# EAGLE design pix-diff-spi-v1a (EAGLE 9.1.0)
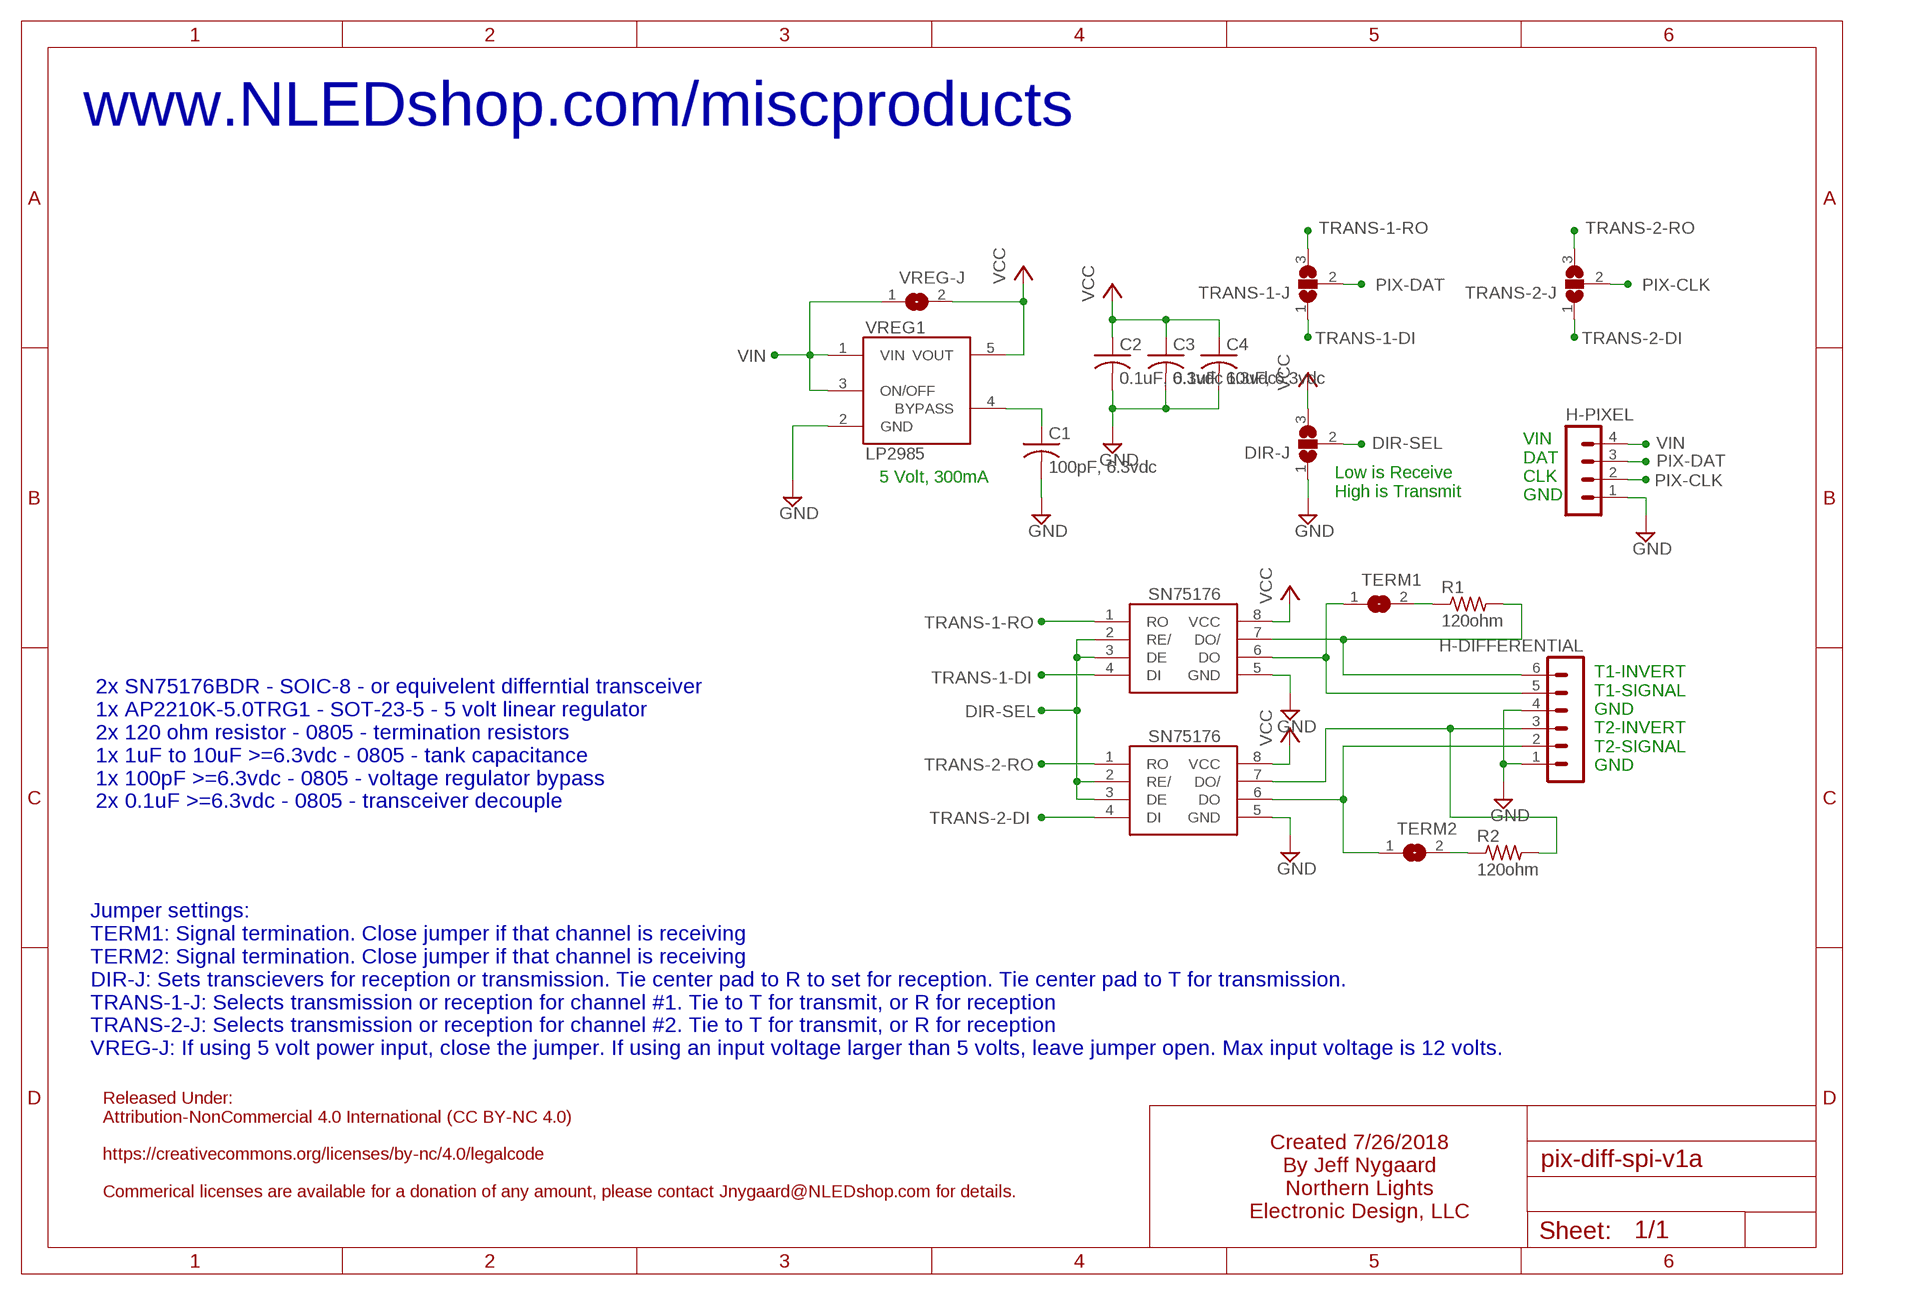
[diagram p0: schematic, sheet 1]

## Parts
C1  100pF, 6.3vdc  C-USC0805  [C0805]
C2  0.1uF, 6.3vdc  C-USC0805  [C0805]
C3  0.1uF, 6.3vdc  C-USC0805  [C0805]
C4  10uF, 6.3vdc  C-USC0805  [C0805]
DIR-J  SJ2W  [SJ_2]
H-DIFFERENTIAL  MA06-1  [MA06-1]
H-PIXEL  MA04-1  [MA04-1]
R1  120ohm  R-US_R0805  [R0805]
R2  120ohm  R-US_R0805  [R0805]
TERM1  SJ  [SJ]
TERM2  SJ  [SJ]
TRANS1  SN75176SMD  [SOIC-8]
TRANS2  SN75176SMD  [SOIC-8]
TRANS-1-J  SJ2W  [SJ_2]
TRANS-2-J  SJ2W  [SJ_2]
VREG1  LP2985AIM5-3.3  [SOT25]
VREG-J  SJ  [SJ]

## Nets
BYPASS: C1.1 VREG1.4(BYPASS)
DIR-SEL: DIR-J.2 TRANS1.2(RE/) TRANS1.3(DE) TRANS2.2(RE/) TRANS2.3(DE)
GND [ground]: C1.2 C2.2 C3.2 C4.2 DIR-J.1 H-DIFFERENTIAL.1 H-DIFFERENTIAL.4 H-PIXEL.1 TRANS1.5(GND) TRANS2.5(GND) VREG1.2(GND)
N$1: R1.1 TERM1.2
N$2: R2.1 TERM2.2
PIX-CLK: H-PIXEL.2 TRANS-2-J.2
PIX-DAT: H-PIXEL.3 TRANS-1-J.2
T1-INVERT: H-DIFFERENTIAL.6 R1.2 TRANS1.7(DO/)
T1-SIGNAL: H-DIFFERENTIAL.5 TERM1.1 TRANS1.6(DO)
T2-INVERT: H-DIFFERENTIAL.3 R2.2 TRANS2.7(DO/)
T2-SIGNAL: H-DIFFERENTIAL.2 TERM2.1 TRANS2.6(DO)
TRANS-1-DI: TRANS1.4(DI) TRANS-1-J.1
TRANS-1-RO: TRANS1.1(RO) TRANS-1-J.3
TRANS-2-DI: TRANS2.4(DI) TRANS-2-J.1
TRANS-2-RO: TRANS2.1(RO) TRANS-2-J.3
VCC: C2.1 C3.1 C4.1 DIR-J.3 TRANS1.8(VCC) TRANS2.8(VCC) VREG1.5(VOUT) VREG-J.2
VIN: H-PIXEL.4 VREG1.1(VIN) VREG1.3(ON/OFF) VREG-J.1

## Notes on the sheet
- www.NLEDshop.com/miscproducts
- 5 Volt, 300mA
- Low is Receive
  High is Transmit
- VIN
  DAT
  CLK
  GND
- T1-INVERT
  T1-SIGNAL
  GND
  T2-INVERT
  T2-SIGNAL
  GND
- 2x SN75176BDR - SOIC-8 - or equivelent differntial transceiver
  1x AP2210K-5.0TRG1 - SOT-23-5 - 5 volt linear regulator
  2x 120 ohm resistor - 0805 - termination resistors
  1x 1uF to 10uF >=6.3vdc - 0805 - tank capacitance
  1x 100pF >=6.3vdc - 0805 - voltage regulator bypass
  2x 0.1uF >=6.3vdc - 0805 - transceiver decouple
- Jumper settings:
  TERM1: Signal termination. Close jumper if that channel is receiving
  TERM2: Signal termination. Close jumper if that channel is receiving
  DIR-J: Sets transcievers for reception or transmission. Tie center pad to R to set for reception. Tie center pad to T for transmission.
  TRANS-1-J: Selects transmission or reception for channel #1. Tie to T for transmit, or R for reception
  TRANS-2-J: Selects transmission or reception for channel #2. Tie to T for transmit, or R for reception
  VREG-J: If using 5 volt power input, close the jumper. If using an input voltage larger than 5 volts, leave jumper open. Max input voltage is 12 volts.
- Created 7/26/2018
  By Jeff Nygaard
  Northern Lights
  Electronic Design, LLC
- Released Under:
  Attribution-NonCommercial 4.0 International (CC BY-NC 4.0)
  
  https://creativecommons.org/licenses/by-nc/4.0/legalcode
  
  Commerical licenses are available for a donation of any amount, please contact Jnygaard@NLEDshop.com for details.

## Library data of the parts
C1-C4 = rcl:C-US: CAPACITOR, American symbol; SPICEPREFIX: C
DIR-J TRANS-1-J TRANS-2-J = jumper:SJ2W: SMD solder JUMPER
H-DIFFERENTIAL = NLED-connectors:MA06-1: PIN HEADER; OC_FARNELL: unknown; OC_NEWARK: unknown
H-PIXEL = con-lstb:MA04-1: PIN HEADER; OC_FARNELL: unknown; OC_NEWARK: unknown
R1 R2 = rcl:R-US_: RESISTOR, American symbol; SPICEPREFIX: R
TERM1 TERM2 VREG-J = jumper:SJ: SMD solder JUMPER
TRANS1 TRANS2 = NLED-integratedcircuit:SN75176
VREG1 = LP2985:LP2985: LP2985-N Micropower 150 mA Low-Noise Ultra Low-Dropout Regulator

## Board
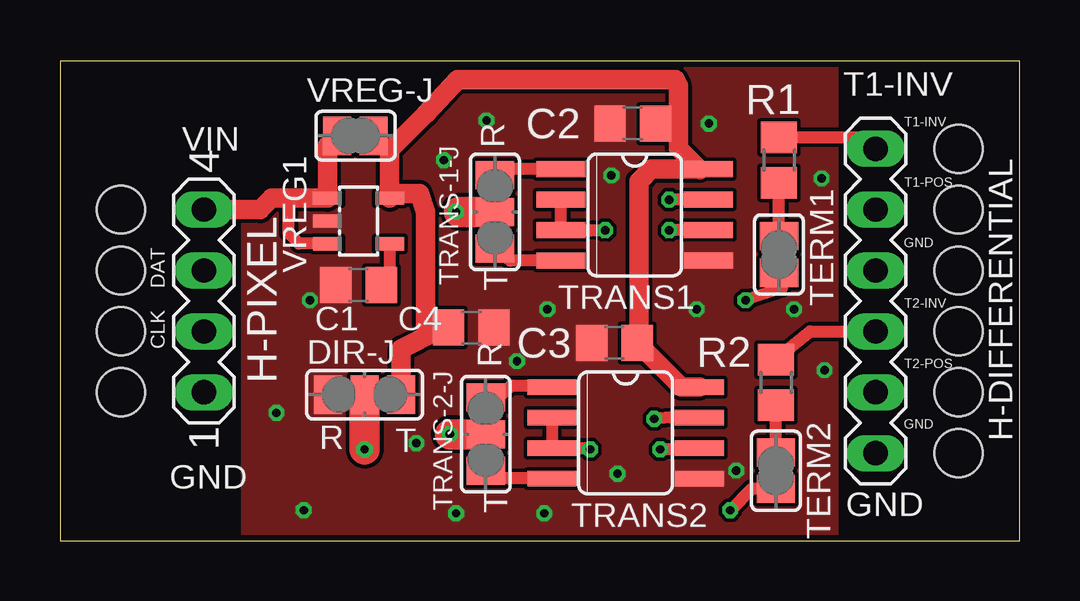
[diagram p1: board, top side]
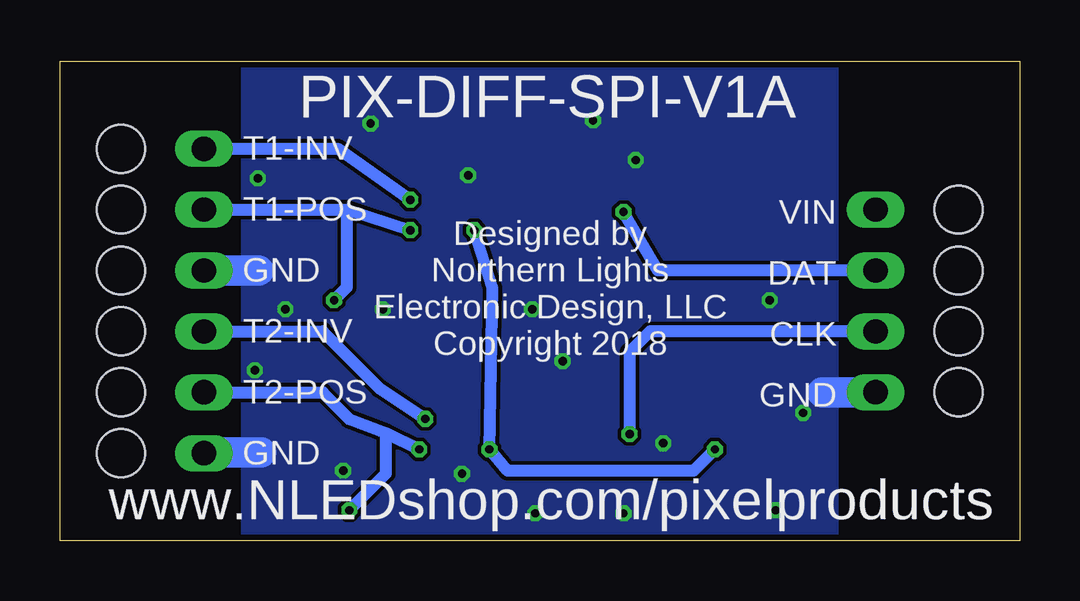
[diagram p2: board, bottom side, seen from below]

Size 40 x 20 mm. Coordinates in mm from the lower left corner, seen from the top.
Outline: 0,0 40,0 40,20 0,20 0,0
Copper layers (1*16): Top 0.035mm / dielectric 1.5mm / Bottom 0.035mm
Design rules "SeeedStudio_2layer_DRU_no_angle_20140221 *": minimum track width 16mil, minimum drill 12mil, track to track 6mil, track to pad 6mil, pad to pad 6mil, via to via 6mil, smd to smd 0mil, copper to edge 10mil, drill to drill 10mil, minimum pad ring 10mil, minimum via ring 6mil, stop-mask expansion 2mil, vias tented up to drill 100mil, thermal gap 10mil
Holes 2 mm at 2.54,6.19 2.54,8.73 2.54,11.27 2.54,13.81 37.46,11.27 37.46,8.73 37.46,6.19 37.46,3.65 37.46,13.81 37.46,16.35

### Footprints (pad centres in the part's own frame; a part is rotated, then mirrored left to right if it is on the bottom)
C0805 = smd 1.3 x 1.5: 1 -0.95,0; 2 0.95,0
SJ_2 = smd 1.168 x 1.6: 1 -1.524,0; 2 0,0; 3 1.524,0
MA06-1 = drill 1.016 long: 1 -6.35,0; 2 -3.81,0; 3 -1.27,0; 4 1.27,0; 5 3.81,0; 6 6.35,0
MA04-1 = drill 1.016 long: 1 -3.81,0; 2 -1.27,0; 3 1.27,0; 4 3.81,0
R0805 = smd 1.3 x 1.5: 1 -0.95,0; 2 0.95,0
SJ = smd 1.168 x 1.6: 1 -0.762,0; 2 0.762,0
SOIC-8 = smd 0.66 x 2.032: 1 -1.905,-3.073; 2 -0.635,-3.073; 3 0.635,-3.073; 4 1.905,-3.073; 5 1.905,3.073; 6 0.635,3.073; 7 -0.635,3.073; 8 -1.905,3.073
SOT25 = smd 0.55 x 1.2: 1 -0.95,-1.3; 2 0,-1.3; 3 0.95,-1.3; 4 0.95,1.3; 5 -0.95,1.3

### Placement (x,y rotation side)
C1  12.45,10.67 180 top
C2  23.88,17.4 180 top
C3  23.11,8.26 180 top
C4  17.14,8.89 0 top
DIR-J  12.7,6.1 0 top
H-DIFFERENTIAL  34,10 90 top
H-PIXEL  6,10 90 top
R1  29.97,15.88 90 top
R2  29.84,6.6 90 top
TERM1  29.97,11.94 90 top
TERM2  29.84,2.92 90 top
TRANS1  23.96,13.59 270 top
TRANS2  23.58,4.5 270 top
TRANS-1-J  18.13,13.72 90 top
TRANS-2-J  17.75,4.45 90 top
VREG1  12.45,13.34 270 top
VREG-J  12.32,16.89 0 top

### Tracks (layer width: path | path; a pad name or v marks a point on that pad's centre or on a via)
BYPASS
  Top 0.508: VREG1.4 13.75,11.06 C1.1
DIR-SEL  (via drill 0.35)
  Top 0.508: TRANS2.2 TRANS2.3 22.04,3.87 v22.1,3.81 | TRANS1.2 20.89,13.97 TRANS1.3 v22.73,12.95
  Top 1.27: DIR-J.2 v12.7,3.81
  Bottom 0.508: v22.73,12.95 21.97,10.54 v22.1,3.81 21.34,2.92 13.59,2.92 v12.7,3.81
GND  (via drill 0.35)
  Bottom 1.016: 8.22,6.19 8.26,6.22 | H-DIFFERENTIAL.1 33.97,3.68 | 31.72,11.27 31.62,11.18
  Bottom 1.27: H-PIXEL.1 8.22,6.19 | 33.97,3.68 31.62,3.68 | H-DIFFERENTIAL.4 31.72,11.27
  other vias: 10.16,1.27 20.19,1.14 27.05,17.4 17.78,17.53 19.05,7.49 20.32,9.65 28.19,2.92 10.41,10.03 31.75,15.11 22.99,15.24 26.54,9.65 23.24,2.79 14.86,4.06 9.02,5.33 16.51,1.14 16,15.88 30.61,9.65 31.88,7.11
  pour Bottom (no thermals): 7.62,20.07 7.62,0 32.38,0 32.38,19.94
  pour Top (no thermals): 7.62,20.07 7.62,0 32.38,0 32.38,19.94
N$1
  Top 0.508: TERM1.2 R1.1
N$2
  Top 0.508: TERM2.2 R2.1
PIX-CLK  (via drill 0.35)
  Top 1.27: TRANS-2-J.2 v16.26,4.45
  Bottom 0.508: H-PIXEL.2 15.4,8.73 16.26,7.87 16.26,5.08 16.26,4.83 v16.26,4.45
PIX-DAT  (via drill 0.35)
  Top 0.508: 16.64,13.72 v16.51,13.72
  Top 1.27: TRANS-1-J.2 16.64,13.72
  Bottom 0.508: H-PIXEL.3 15.08,11.27 v16.51,13.72
T1-INVERT  (via drill 0.35)
  Top 0.508: TRANS1.7 26.16,14.22 v25.4,14.22 | R1.2 33.52,16.82 H-DIFFERENTIAL.6
  Bottom 0.508: H-DIFFERENTIAL.6 28.41,16.35 v25.4,14.22
T1-SIGNAL  (via drill 0.35)
  Top 0.508: TRANS1.6 v25.4,12.95 | TERM1.1 30.1,10.54 v28.57,10.03
  Bottom 0.508: H-DIFFERENTIAL.5 28.03,13.81 | 28.03,13.81 v25.4,12.95 | v28.57,10.03 28.03,10.57 28.03,13.81
T2-INVERT  (via drill 0.35)
  Top 0.508: TRANS2.7 25.45,5.13 v24.77,5.08 | R2.2 31.27,8.73 H-DIFFERENTIAL.3
  Bottom 0.508: H-DIFFERENTIAL.3 29.05,8.73 26.67,6.35 v24.77,5.08
T2-SIGNAL  (via drill 0.35)
  Top 0.508: TRANS2.6 26.22,3.81 v25.02,3.81 | TERM2.1 28.83,2.16 v27.94,1.27
  Bottom 0.508: 26.41,4.49 27.94,5.08 29.05,6.19 H-DIFFERENTIAL.2 | 26.41,4.49 v25.02,3.81 | v27.94,1.27 26.41,2.8 26.41,4.49
TRANS-1-DI
  Top 0.508: TRANS1.4 18.77,11.68 TRANS-1-J.1
TRANS-1-RO
  Top 0.508: TRANS1.1 18.51,15.49 TRANS-1-J.3
TRANS-2-DI
  Top 0.508: TRANS2.4 18.2,2.6 TRANS-2-J.1
TRANS-2-RO
  Top 0.508: TRANS-2-J.3 18.29,5.97 18.8,6.48 20.05,6.48 TRANS2.1
VCC
  Top 0.508: TRANS1.8 26.67,15.49 26.16,15.48 | 25.78,17.4 C2.1 | VREG1.5 13.75,14.61 13.75,16.23 VREG-J.2 | C4.1 16.07,9.14 15.24,9.02
  Top 0.813: VREG1.5 13.75,14.61 | 13.75,14.61 13.75,16.29 15.24,17.78 16.57,19.24 25.65,19.24 25.78,18.98 25.78,17.78 | 25.78,17.78 25.78,17.4 | DIR-J.3 14.22,6.6 14.22,8 15.75,8.76 15.24,9.02 15.24,13.72 14.99,14.48 13.87,14.48 13.75,14.61 | TRANS2.8 25.91,6.41 C3.1 24.13,8.32 24.13,14.99 24.64,15.49 26.66,15.49 | 26.66,15.49 26.67,15.49 | 25.78,17.78 25.78,16.38 26.66,15.49
VIN
  Top 0.508: 11.15,16.48 VREG-J.1 | VREG1.3 9.97,12.38 9.53,12.83 9.53,14.29
  Top 0.813: 11.15,16.48 VREG1.1 9.53,14.29 8.82,14.29 8.35,13.81 H-PIXEL.4

### Text on the board
tNames: T1-INV | VIN | R | DAT | T1-INV / / T1-POS / / GND / / T2-INV / / T2-POS / / GND | T | CLK | R | R | T | GND | T | GND
bNames: PIX-DIFF-SPI-V1A | Designed by / Northern Lights / Electronic Design, LLC / Copyright 2018 | VIN / DAT / CLK / GND | T1-INV / T1-POS / GND / T2-INV / T2-POS / GND | www.NLEDshop.com/pixelproducts